# Altium schematic sheet Laser_STM32_System.SchDoc
size A4; SheetNumber: 4; SheetTotal: 4
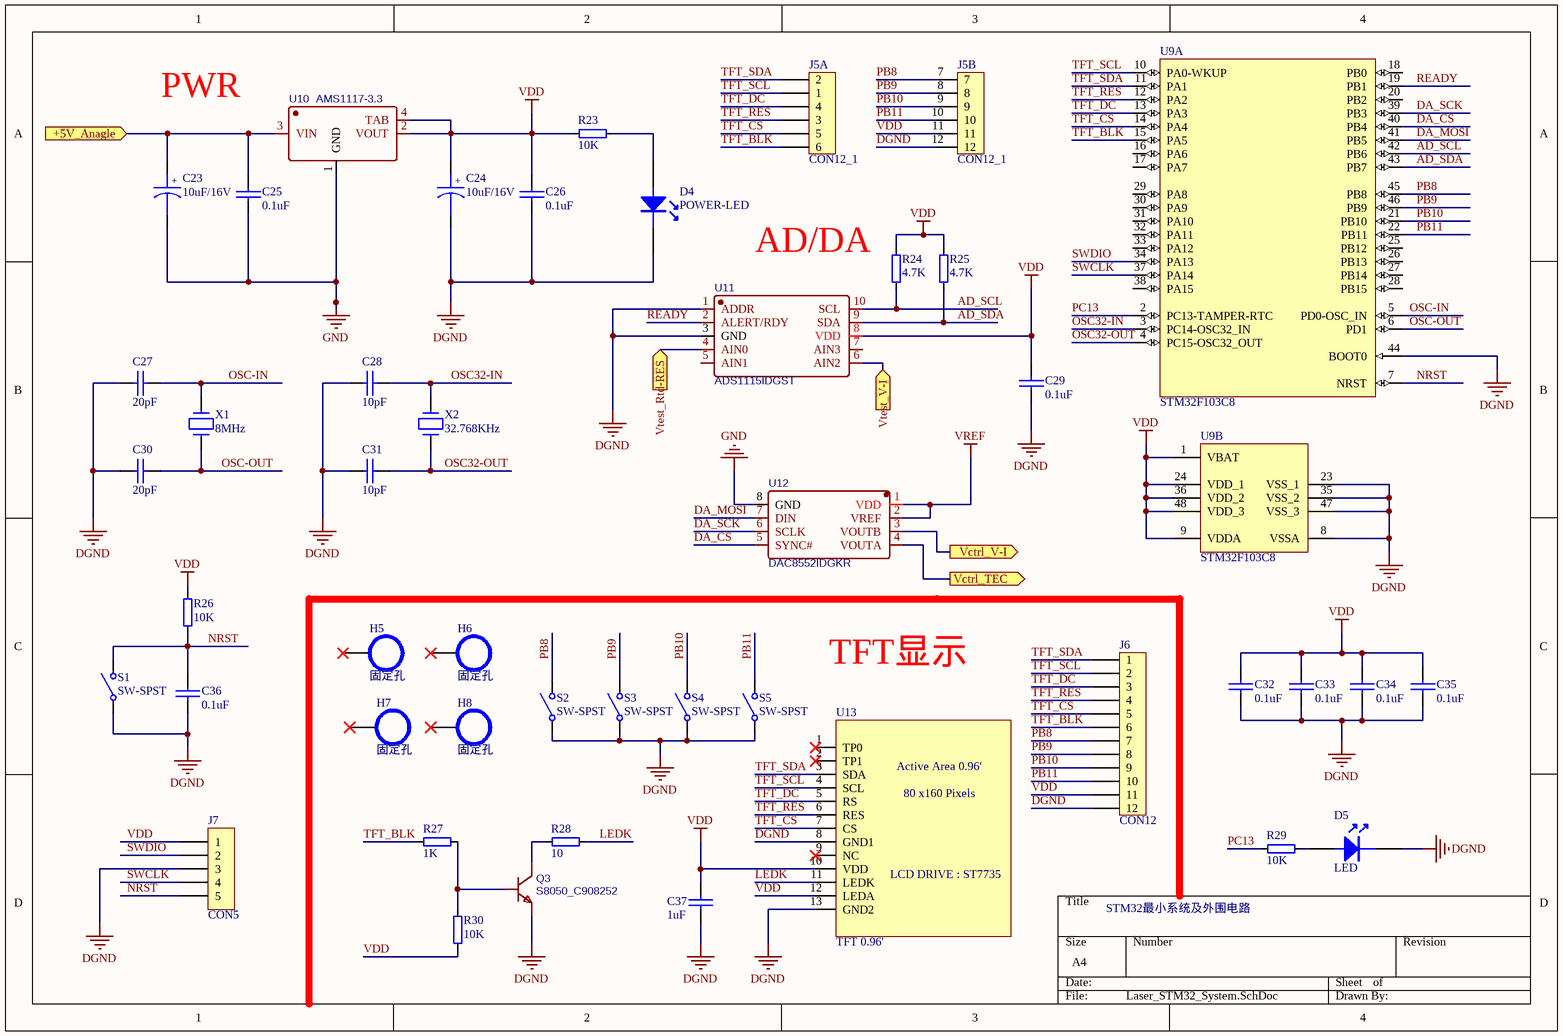
[diagram p0: Laser_STM32_System.SchDoc]

## Parts
C23  10uF/16V  [CAP-TH_BD5.0-P2.00-D0.8-FD]
C24  10uF/16V  [CAP-TH_BD5.0-P2.00-D0.8-FD]
C25  0.1uF  [C 0603_M]
C26  0.1uF  [C 0603_M]
C27  20pF  [C 0603_M]
C28  10pF  [C 0603_M]
C29  0.1uF  [C 0603_M]
C30  20pF  [C 0603_M]
C31  10pF  [C 0603_M]
C32  0.1uF  [C 0603_M]
C33  0.1uF  [C 0603_M]
C34  0.1uF  [C 0603_M]
C35  0.1uF  [C 0603_M]
C36  0.1uF  [C 0603_M]
C37  1uF  [C 0603_M]
D4  POWER-LED  [LED 0805R]
D5  LED  [LED 0805R]
H5  固定孔  [铜柱孔3]
H6  固定孔  [铜柱孔3]
H7  固定孔  [铜柱孔3]
H8  固定孔  [铜柱孔3]
J5  CON12_1  [XH2.54-WI-12P]  (parts A,B of 2)
J6  CON12  [XH2.54-WI-12P]
J7  CON5  [HDR2.54-LI-5P]
Q3  S8050_C908252  [SOT-23-3_L2.9-W1.3-P1.90-LS2.4-BR]
R23  10K  [0603R]
R24  4.7K  [0603R]
R25  4.7K  [0603R]
R26  10K  [0603R]
R27  1K  [0603R]
R28  10  [0603R]
R29  10K  [0603R]
R30  10K  [0603R]
S1  SW-SPST  [TSW SMD-3*6*2.5]
S2  SW-SPST  [TSW DIP-6*6*5]
S3  SW-SPST  [TSW DIP-6*6*5]
S4  SW-SPST  [TSW DIP-6*6*5]
S5  SW-SPST  [TSW DIP-6*6*5]
U9  STM32F103C8  [LQFP-48_L7.0-W7.0-P0.50-LS9.0-BL]  (parts A,B of 2)
U10  AMS1117-3.3  [SOT-223-4_L6.5-W3.5-P2.30-LS7.0-BR]
U11  ADS1115IDGST  [VSSOP-10_L3.0-W3.0-P0.50-LS4.9-BL]
U12  DAC8552IDGKR  [VSSOP-8_L3.0-W3.0-P0.65-LS5.0-BL]
U13  TFT 0.96'  [TFT0.96-13P]
X1  8MHz  [OSC HC-49S]
X2  32.768KHz  [OSC-3x8-LI]

## Ports
+5V_Anagle (in), Vctrl_TEC (out), Vctrl_V-I (out), Vtest_Rtd-RES (in), Vtest_V-I (in)

## Nets
DGND: C24.2 C26.2 C27.1 C28.1 C29.2 C30.1 C31.1 C32.2 C33.2 C34.2 C35.2 C36.2 C37.1 D4.2 D5.2 J5.12 J6.12 J7.3 Q3.2(E) S1.1(COMMON) S2.1(COMMON) S3.1(COMMON) S4.1(COMMON) S5.1(COMMON) U9.8(VSSA) U9.23(VSS_1) U9.35(VSS_2) U9.44(BOOT0) U9.47(VSS_3) U11.1(ADDR) U11.3(GND) U13.8(GND1) U13.13(GND2)
GND: C23.2 C25.2 U10.1(GND) U12.8(GND)
VDD: C24.1 C26.1 C29.1 C32.1 C33.1 C34.1 C35.1 C37.2 J5.11 J6.11 J7.1 R23.1 R24.2 R25.2 R26.2 R30.1 U9.1(VBAT) U9.9(VDDA) U9.24(VDD_1) U9.36(VDD_2) U9.48(VDD_3) U10.2(VOUT) U10.4(TAB) U11.8(VDD) U13.10(VDD) U13.12(LEDA)
VREF: U12.1(VDD) U12.2(VREF)
+5V_Anagle: C23.1 C25.1 U10.3(VIN) ; port +5V_Anagle
AD_SCL: R24.1 U9.42(PB6) U11.10(SCL)
AD_SDA: R25.1 U9.43(PB7) U11.9(SDA)
DA_~{CS}: U9.40(PB4) U12.5(SYNC#)
DA_MOSI: U9.41(PB5) U12.7(DIN)
DA_SCK: U9.39(PB3) U12.6(SCLK)
LEDK: R28.2 U13.11(LEDK)
NRST: C36.1 J7.5 R26.1 S1.2(NO) U9.7(NRST)
OSC32-IN: C28.2 U9.3(PC14-OSC32_IN) X2.2
OSC32-OUT: C31.2 U9.4(PC15-OSC32_OUT) X2.1
OSC-IN: C27.2 U9.5(PD0-OSC_IN) X1.2
OSC-OUT: C30.2 U9.6(PD1) X1.1
PB8: J5.7 J6.7 S2.2(NO) U9.45(PB8)
PB9: J5.8 J6.8 S3.2(NO) U9.46(PB9)
PB10: J5.9 J6.9 S4.2(NO) U9.21(PB10)
PB11: J5.10 J6.10 S5.2(NO) U9.22(PB11)
PC13: R29.1 U9.2(PC13-TAMPER-RTC)
READY: U9.19(PB1) U11.2(ALERT/RDY)
SWCLK: J7.4 U9.37(PA14)
SWDIO: J7.2 U9.34(PA13)
TFT_BLK: J5.6 J6.6 R27.1 U9.15(PA5)
TFT_CS: J5.5 J6.5 U9.14(PA4) U13.7(CS)
TFT_DC: J5.4 J6.3 U9.13(PA3) U13.5(RS)
TFT_RES: J5.3 J6.4 U9.12(PA2) U13.6(RES)
TFT_SCL: J5.1 J6.2 U9.10(PA0-WKUP) U13.4(SCL)
TFT_SDA: J5.2 J6.1 U9.11(PA1) U13.3(SDA)
Vctrl_TEC: U12.4(VOUTA) ; port Vctrl_TEC
Vctrl_V-I: U12.3(VOUTB) ; port Vctrl_V-I
Vtest_Rtd-RES: U11.4(AIN0) ; port Vtest_Rtd-RES
Vtest_V-I: U11.6(AIN2) ; port Vtest_V-I
NetD4_1: D4.1 R23.2
NetD5_1: D5.1 R29.2
NetQ3_1: Q3.1(B) R27.2 R30.2
NetQ3_3: Q3.3(C) R28.1

Not connected (* = marked no-connect by the designer): H5 11*; H6 11*; H7 11*; H8 11*; U9 16(PA6) 17(PA7) 18(PB0) 20(PB2) 25(PB12) 26(PB13) 27(PB14) 28(PB15) 29(PA8) 30(PA9) 31(PA10) 32(PA11) 33(PA12) 38(PA15); U11 5(AIN1) 7(AIN3); U13 1(TP0)* 2(TP1)* 9(NC)*

## Notes on the sheet
- PWR
- AD/DA
- TFT显示
- STM32最小系统及外围电路
- (in symbol TFT显示屏) Active Area 0.96'; 80 x160 Pixels; LCD DRIVE : ST7735
- (in symbol 电解电容1) +

## Library data of the parts
C23 C24 = 电解电容1: Capacitor
C25-C37 = 普通电容: Capacitor
D4 D5 = 发光二极管
J5 = CON12_1: Connector
J6 = CON12: Connector
J7 = CON5: Connector
Q3 = S8050_C908252: BOM_Manufacturer: FUXINSEMI; BOM_Manufacturer Part: S8050; Contributor: LCSC; BOM_Supplier: LCSC; BOM_Supplier Part: C908252; BOM_JLCPCB Part Class: Extended Part; spicePre: Q; spiceSymbolName: S8050_C908252
R23-R30 = 普通电阻
S1-S5 = SW-SPST: Single-Pole, Single-Throw Switch; Published: 24-Mar-1999; LatestRevisionDate: 17-Jul-2002; LatestRevisionNote: Re-released for DXP Platform.; PackageReference: SPST-2; Publisher: Altium Limited
U9 = STM32F103C8_A: Flaah:64/RAM:20/IO:36; BOM名称: 32位STM单片机; 版权归属: 源创客; 学习资源: www.ooocke.com
U10 = AMS1117-3.3: BOM_Manufacturer: Youtai Semiconductor Co., Ltd.; Contributor: LCSC; BOM_Supplier: LCSC; BOM_Supplier Part: C347256; BOM_Manufacturer Part: AMS1117-3.3; BOM_JLCPCB Part Class: Extended Part; spicePre: U; spiceSymbolName: AMS1117-3.3_C347256
U11 = ADS1115IDGST: BOM_Manufacturer: Texas Instruments; Contributor: LCSC; BOM_Supplier: LCSC; BOM_Supplier Part: C468683; BOM_Manufacturer Part: ADS1115IDGST; BOM_JLCPCB Part Class: Extended Part; spicePre: U; spiceSymbolName: ADS1115IDGST
U12 = DAC8552IDGKR: BOM_Manufacturer: Texas Instruments; Contributor: LCSC; BOM_Supplier: LCSC; BOM_Supplier Part: C136020; BOM_Manufacturer Part: DAC8552IDGKR; BOM_JLCPCB Part Class: Extended Part; spicePre: U; spiceSymbolName: DAC8552IDGKR
U13 = TFT显示屏
X1 X2 = CRYSTAL